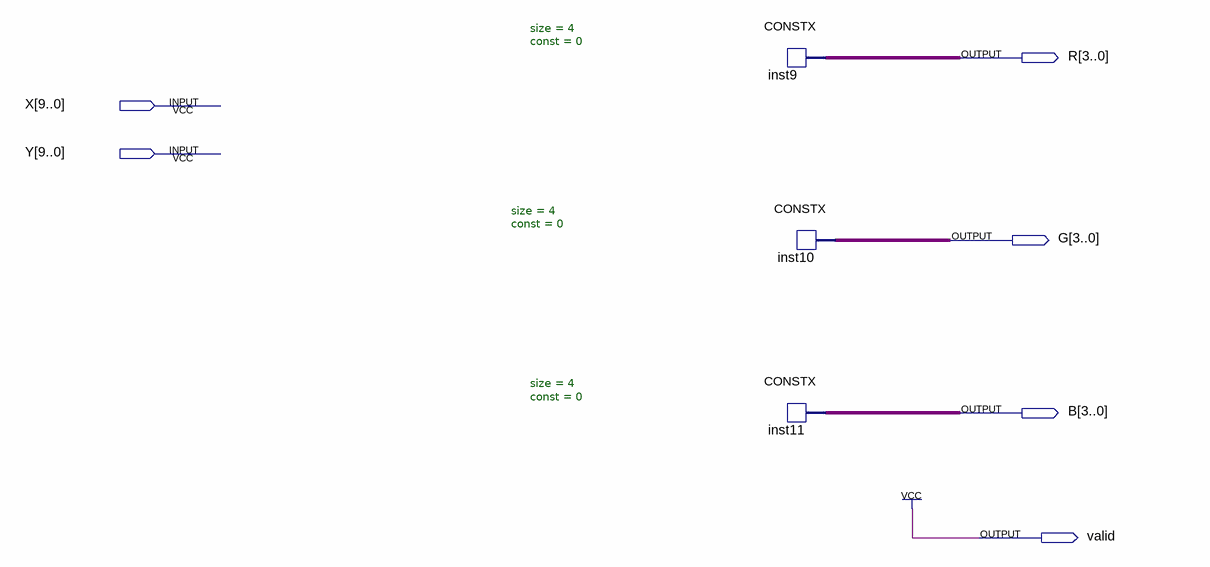
[diagram p0: schematic sheet]
// Quartus schematic pozadina.bdf as structural Verilog: 3 symbols, 6 pins
module pozadina (
  input  [9:0] X,
  input  [9:0] Y,
  output [3:0] R,
  output [3:0] G,
  output [3:0] B,
  output valid
);

  CONSTX #(.size(4), .\const (0)) inst9 (.data(R));
  CONSTX #(.size(4), .\const (0)) inst11 (.data(B));
  CONSTX #(.size(4), .\const (0)) inst10 (.data(G));

  assign valid = 1'b1;
endmodule
